# Altium project PCB_Project_1.PrjPcb
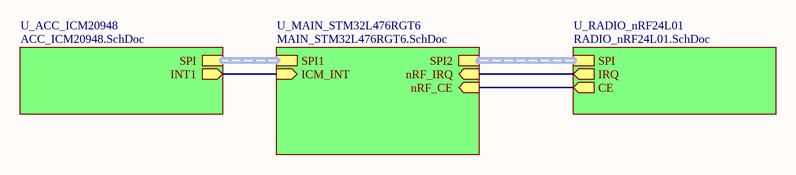
[diagram p0: mHealth.SchDoc]
4 sheets, 29 parts. Net scope: hierarchical (ports join the sheet entries above them; power ports are global).
Board file: CORE_Prototype_1.PcbDoc
Sheets:
  mHealth.SchDoc
    U_MAIN_STM32L476RGT6 = MAIN_STM32L476RGT6.SchDoc
    U_ACC_ICM20948 = ACC_ICM20948.SchDoc
    U_RADIO_nRF24L01 = RADIO_nRF24L01.SchDoc

## Sheet mHealth.SchDoc
size Letter; SheetNumber: 1

### Sub-sheets
U_ACC_ICM20948 = ACC_ICM20948.SchDoc: SPI (harness SPI), INT1 (out)
U_MAIN_STM32L476RGT6 = MAIN_STM32L476RGT6.SchDoc: nRF_IRQ (in), ICM_INT (in), SPI2 (harness SPI), nRF_CE (in), SPI1 (harness SPI)
U_RADIO_nRF24L01 = RADIO_nRF24L01.SchDoc: IRQ (out), CE (out), SPI (harness SPI)

### Nets
CE: sheet U_MAIN_STM32L476RGT6/nRF_CE, sheet U_RADIO_nRF24L01/CE
ICM_INT: sheet U_MAIN_STM32L476RGT6/ICM_INT, sheet U_ACC_ICM20948/INT1
IRQ: sheet U_MAIN_STM32L476RGT6/nRF_IRQ, sheet U_RADIO_nRF24L01/IRQ

### Buses and harness runs
harness sheet U_ACC_ICM20948/SPI = sheet U_MAIN_STM32L476RGT6/SPI1
harness sheet U_MAIN_STM32L476RGT6/SPI2 = sheet U_RADIO_nRF24L01/SPI

## Sheet MAIN_STM32L476RGT6.SchDoc
size B; SheetNumber: 4
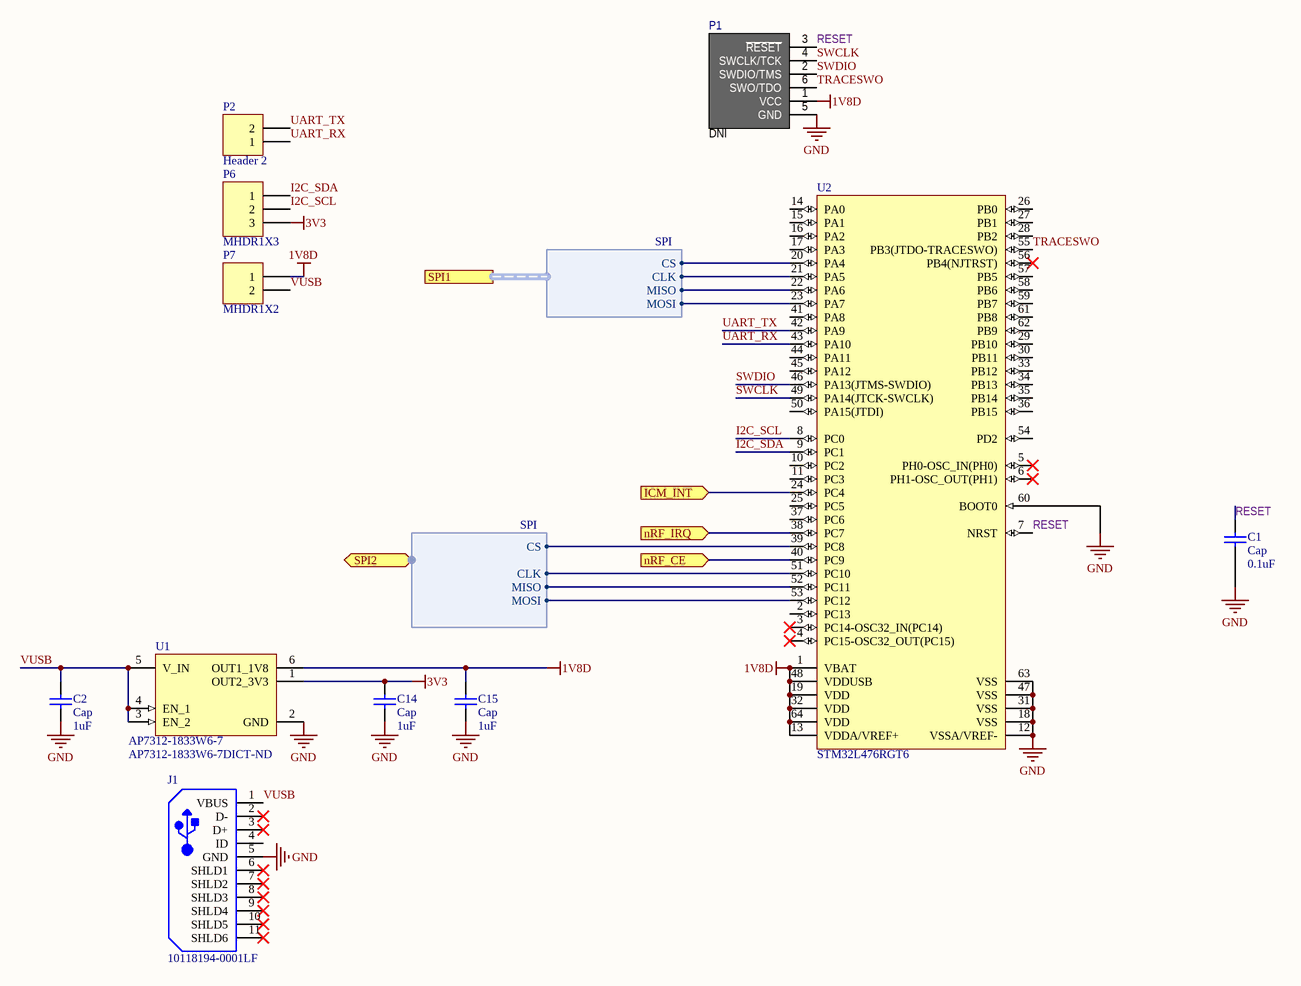
[diagram p1: MAIN_STM32L476RGT6.SchDoc]

### Parts
C1  Cap  value 0.1uF  [CAPC1005N]
C2  Cap  value 1uF  [CAPC1005N]
C14  Cap  value 1uF  [CAPC1005N]
C15  Cap  value 1uF  [CAPC1005N]
J1  10118194-0001LF  [FCI-10118194-0001LF-5_V]
P1  DNI  [TC2030]  (no BOM)
P2  Header 2  [HDR1X2-PINS]
P6  MHDR1X3  [MHDR1X3]
P7  MHDR1X2  [MHDR1X2]
U1  AP7312-1833W6-7  Supplier Part Number 1: AP7312-1833W6-7DICT-ND  [SOT95P285X145-6N]
U2  STM32L476RGT6  [STM-LQFP64_N]

### Ports
ICM_INT (in), nRF_CE (in), nRF_IRQ (in), SPI1 (harness SPI), SPI2 (bidir, harness SPI)

### Harnesses
SPI: MOSI, MISO, CS, CLK

### Nets
1V8D: C15.2 P1.1(VCC) P7.1 U1.6(OUT1_1V8) U2.1(VBAT) U2.13(VDDA/VREF+) U2.19(VDD) U2.32(VDD) U2.48(VDDUSB) U2.64(VDD)
3V3: C14.2 P6.3 U1.1(OUT2_3V3)
GND: C1.1 C2.1 C14.1 C15.1 J1.5(GND) P1.5(GND) U1.2(GND) U2.12(VSSA/VREF-) U2.18(VSS) U2.31(VSS) U2.47(VSS) U2.60(BOOT0) U2.63(VSS)
CE: U2.40(PC9) ; port nRF_CE
I2C_SCL: P6.2 U2.8(PC0)  [project net I2C_SCL_4]
I2C_SDA: P6.1 U2.9(PC1)  [project net I2C_SDA_4]
ICM_INT: U2.24(PC4) ; port ICM_INT
IRQ: U2.38(PC7) ; port nRF_IRQ
RESET: C1.2 P1.3(~{RESET}) U2.7(NRST)  [project net RESET_4]
SWCLK: P1.4(SWCLK/TCK) U2.49(PA14(JTCK-SWCLK))  [project net SWCLK_4]
SWDIO: P1.2(SWDIO/TMS) U2.46(PA13(JTMS-SWDIO))  [project net SWDIO_4]
TRACESWO: P1.6(SWO/TDO) U2.55(PB3(JTDO-TRACESWO))  [project net TRACESWO_4]
UART_RX: P2.1 U2.43(PA10)  [project net UART_RX_4]
UART_TX: P2.2 U2.42(PA9)  [project net UART_TX_4]
VUSB: C2.2 J1.1(VBUS) P7.2 U1.3(EN_2) U1.4(EN_1) U1.5(V_IN)  [project net VUSB_4]
NetP3_1: U2.20(PA4) ; port SPI1.CS
NetP3_2: U2.22(PA6) ; port SPI1.MISO
NetP3_3: U2.23(PA7) ; port SPI1.MOSI
NetP3_4: U2.21(PA5) ; port SPI1.CLK
NetP5_1: U2.51(PC10) ; port SPI2.CLK
NetP5_2: U2.53(PC12) ; port SPI2.MOSI
NetP5_3: U2.52(PC11) ; port SPI2.MISO
NetP5_4: U2.39(PC8) ; port SPI2.CS

Not connected (* = marked no-connect by the designer): J1 2(D-)* 3(D+)* 4(ID) 6(SHLD1)* 7(SHLD2)* 8(SHLD3)* 9(SHLD4)* 10(SHLD5)* 11(SHLD6)*; U2 2(PC13) 3(PC14-OSC32_IN(PC14))* 4(PC15-OSC32_OUT(PC15))* 5(PH0-OSC_IN(PH0))* 6(PH1-OSC_OUT(PH1))* 10(PC2) 11(PC3) 14(PA0) 15(PA1) 16(PA2) 17(PA3) 25(PC5) 26(PB0) 27(PB1) 28(PB2) 29(PB10) 30(PB11) 33(PB12) 34(PB13) 35(PB14) 36(PB15) 37(PC6) 41(PA8) 44(PA11) 45(PA12) 50(PA15(JTDI)) 54(PD2) 56(PB4(NJTRST))* 57(PB5) 58(PB6) 59(PB7) 61(PB8) 62(PB9)

### Library data of the parts
C1 C2 C14 C15 = Cap: Capacitor; Published: 8-Jun-2000; LatestRevisionDate: 17-Jul-2002; LatestRevisionNote: Re-released for DXP Platform.; PackageReference: RAD-0.3; Publisher: Altium Limited; PackageDescription: Radial Cap, Thru-Hole; 2 Leads; 0.3 in Pin Spacing
J1 = CMP-2000-05120-1: Micro USB B Type Receptacle, 1.8 A, -55 to 85 degC, 5-Pin SMD, RoHS, Tape and Reel; Manufacturer: Amphenol FCI; Body Orientation: RightAngle; Number of Contacts: 5; Pitch: 0.65mm; Gender: RCP; Rad Hard: No; Package Reference: 10118194-0001LF-5; Mounting: SurfaceMount; Manufacturer URL: http://www.fci.com/; Packaging: CutTape; Datasheet URL: https://datasheet.ciiva.com/26945/getdatasheetpartid-418619-26945695.pdf; Termination Method: Solder; Package Description: 5-Pin Surface Mount Device, Body 8.05 x 5.53 mm, Pitch 0.65 mm; Type: MicroUSBTypeB; Datasheet Version: Rev. A, 10/2011
P1 = TC2030-CTX
P2 = Header 2: Header, 2-Pin; LatestRevisionDate: 17-Jul-2002; LatestRevisionNote: Re-released for DXP Platform.; Publisher: Altium Limited
P6 = MHDR1X3: Header, 3-Pin; LatestRevisionDate: 17-Jul-2002; LatestRevisionNote: Re-released for DXP Platform.; Publisher: Altium Limited
P7 = MHDR1X2: Header, 2-Pin; LatestRevisionDate: 17-Jul-2002; LatestRevisionNote: Re-released for DXP Platform.; Publisher: Altium Limited
U1 = AP7312-1833W6-7: IC REG LINEAR 1.8V/3.3V SOT26; Manufacturer 1: Diodes; Number of Outputs: 2; Min Input Voltage: 2V; Max Input Voltage: 6V; Max Output Current: 150mA; Max Power Dissipation: 950mW; Polarity: Positive; Quiescent Current: 80uA; Accuracy: 2%; Output Type: Fixed; Dropout Voltage: 150mV; Output Voltage: 3.3V; Min Current Limit: 200mA; Operating Supply Current: 60uA; Voltage - Output 1: 1.8V; Reference Voltage: 800mV; Power Supply Rejection Ratio (PSRR): 65dB; Supplier 1: Digi-Key; Manufacturer Part Number 1: AP7312-1833W6-7; Stock 1: 17585; Pricing 1: 1=0.59000, 10=0.52100, 100=0.37100, 500=0.29994, 1000=0.22890 (USD); RoHS: Yes; Mount: Surface Mount; Case/Package: SOT-26; Number of Pins: 6; Contact Plating: Tin,Matte; Min Operating Temperature: -40°C; Max Operating Temperature: 85°C; Output Current: 150mA; Package Quantity: 3000; Packaging: Tape and Reel; Power Rating: 950mW; Number of Regulators: 2; Current - Output 1: 150mA; Current - Output 2: 150mA; Voltage - Output 2: 3.3V; Power Dissipation: 950mW; Output Voltage Accuracy: 2%; Length: 3.1mm; Height: 1.3mm; Width: 1.7mm; Radiation Hardening: No; REACH SVHC: No SVHC; Lead Free: Lead Free; ComponentLink1URL: https://datasheet.ciiva.com/30477/0900766b8115c2c0-30477178.pdf?src-supplier=RSComponents; ComponentLink1Description: https://datasheet.ciiva.com/30477/0900766b8115c2c0-30477178.pdf?src-supplier=RSComponents; ComponentLink2URL: https://datasheet.ciiva.com/8078/1636610-8078247.pdf?src-supplier=Element14; ComponentLink2Description: https://datasheet.ciiva.com/8078/1636610-8078247.pdf?src-supplier=Element14; ComponentLink3URL: https://datasheet.ciiva.com/8239/ap7312-8239997.pdf?src-supplier=Avnet; ComponentLink3Description: https://datasheet.ciiva.com/8239/ap7312-8239997.pdf?src-supplier=Avnet
U2 = CMP-1655-00012-2: Ultra-Low-Power ARM Cortex-M4 32-bit MCU+FPU, 1024 KB Flash, 128 KB Internal RAM, 51 I/Os, 64-Pin LQFP, -40 to 85 degC, Tray; Manufacturer: STMicroelectronics; D/A Converter: 2; Supply Voltage(Vcc) min (V): 1.71; Internal RAM Size (kB): 128; Operating Frequency(F) (Processor speed) (MHz): 80; FLASH Size (Prog) (kB): 1024; I/Os (High Current): 51; Core: ARM Cortex-M4; Package Reference: LQFP64; DatasheetVersion: Rev. 4; ComponentLink1URL: http://www.st.com/; ComponentLink2Description: Datasheet; Mounting Technology: Surface Mount; Package Description: 64-Pin Low-profile Quad Flat Package, Body 10 x 10 mm, Pitch 0.5 mm; ComponentLink1Description: Manufacturer URL; ComponentLink2URL: http://www.st.com/st-web-ui/static/active/en/resource/technical/document/datasheet/DM00108832.pdf; Packing: Tray; PartNumber: STM32L476RGT6

## Sheet ACC_ICM20948.SchDoc
size A; SheetNumber: 2
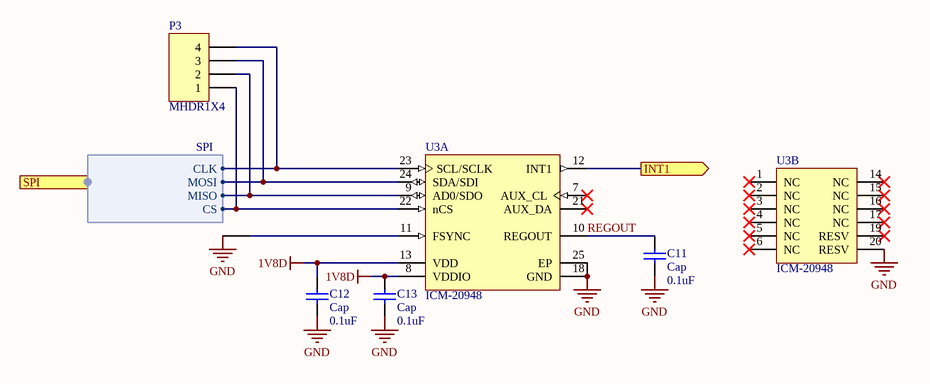
[diagram p2: ACC_ICM20948.SchDoc]

### Parts
C11  Cap  value 0.1uF  [CAPC1005N]
C12  Cap  value 0.1uF  [CAPC1005N]
C13  Cap  value 0.1uF  [CAPC1005N]
P3  MHDR1X4  [MHDR1X4]
U3  ICM-20948  [TDK-QFN-24_M]  (parts A,B of 2)

### Ports
INT1 (out), SPI (harness SPI)

### Harnesses
SPI: MOSI, MISO, CS, CLK

### Nets
1V8D: C12.2 C13.2 U3.8(VDDIO) U3.13(VDD)
GND: C11.1 C12.1 C13.1 U3.11(FSYNC) U3.18(GND) U3.20(RESV) U3.25(EP)
ICM_INT: U3.12(INT1) ; port INT1
REGOUT: C11.2 U3.10(REGOUT)  [project net REGOUT_2]
NetP3_1: P3.1 U3.22(nCS) ; port SPI.CS
NetP3_2: P3.2 U3.9(AD0/SDO) ; port SPI.MISO
NetP3_3: P3.3 U3.24(SDA/SDI) ; port SPI.MOSI
NetP3_4: P3.4 U3.23(SCL/SCLK) ; port SPI.CLK

Not connected (* = marked no-connect by the designer): U3 1(NC)* 2(NC)* 3(NC)* 4(NC)* 5(NC)* 6(NC)* 7(AUX_CL)* 14(NC)* 15(NC)* 16(NC)* 17(NC)* 19(RESV)* 21(AUX_DA)*

### Library data of the parts
C11-C13 = Cap: Capacitor; Published: 8-Jun-2000; LatestRevisionDate: 17-Jul-2002; LatestRevisionNote: Re-released for DXP Platform.; PackageReference: RAD-0.3; Publisher: Altium Limited; PackageDescription: Radial Cap, Thru-Hole; 2 Leads; 0.3 in Pin Spacing
P3 = MHDR1X4: Header, 4-Pin; LatestRevisionDate: 17-Jul-2002; LatestRevisionNote: Re-released for DXP Platform.; Publisher: Altium Limited
U3 = CMP-2000-07532-1: World’s Lowest Power 9-Axis MEMS MotionTracking(TM) Device, 1.71 to 3.6 V, -40 to 85 degC, 24-Pin QFN, RoHS, Tape and Reel; Manufacturer: TDK; Package Description: 24-Pin Quad Flat No-lead Package, Body 3 x 3 mm, Pitch 0.4 mm; Datasheet Version: Rev. 1.3, 06/2017; Package Reference: QFN-24; Mounting Technology: SurfaceMount; Datasheet URL: https://www.invensense.com/wp-content/uploads/2016/06/DS-000189-ICM-20948-v1.3.pdf; Manufacturer URL: http://www.tdk.com/

## Sheet RADIO_nRF24L01.SchDoc
size A; SheetNumber: 5
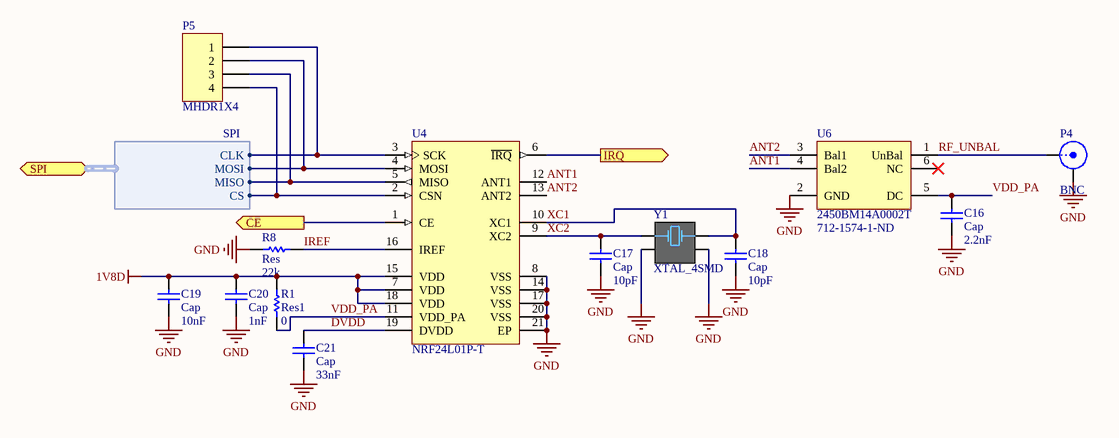
[diagram p3: RADIO_nRF24L01.SchDoc]

### Parts
C16  Cap  value 2.2nF  [CAPC1005N]
C17  Cap  value 10pF  [CAPC1005N]
C18  Cap  value 10pF  [CAPC1005N]
C19  Cap  value 10nF  [CAPC1005N]
C20  Cap  value 1nF  [CAPC1005N]
C21  Cap  value 33nF  [CAPC1005N]
P4  BNC  [MCB3-V4]
P5  MHDR1X4  [MHDR1X4]
R1  Res1  value 0  [RESC1005N]
R8  Res  value 22k  [RESC1005N]
U4  NRF24L01P-T  [NRSC-QFN-20_L]
U6  2450BM14A0002T  Supplier Part Number 1: 712-1574-1-ND  [2450BM14A0002]
Y1  XTAL_4SMD  [XTAL3225-4-N]

### Ports
CE (out), IRQ (out), SPI (bidir, harness SPI)

### Harnesses
SPI: MOSI, MISO, CS, CLK

### Nets
1V8D: C19.2 C20.2 R1.2 U4.7(VDD) U4.15(VDD) U4.18(VDD)
GND: C16.1 C17.1 C18.1 C19.1 C20.1 C21.1 P4.2(Y) R8.1 U4.8(VSS) U4.14(VSS) U4.17(VSS) U4.20(VSS) U4.21(EP) U6.2(GND) Y1.2 Y1.4
ANT1: U4.12(ANT1) U6.4(Bal2)  [project net ANT1_5]
ANT2: U4.13(ANT2) U6.3(Bal1)  [project net ANT2_5]
CE: U4.1(CE) ; port CE
DVDD: C21.2 U4.19(DVDD)  [project net DVDD_5]
IREF: R8.2 U4.16(IREF)  [project net IREF_5]
IRQ: U4.6(~{IRQ}) ; port IRQ
RF_UNBAL: P4.1(X) U6.1(UnBal)  [project net RF_UNBAL_5]
VDD_PA: C16.2 R1.1 U4.11(VDD_PA) U6.5(DC)  [project net VDD_PA_5]
XC1: C18.2 U4.10(XC1) Y1.3(OSC2)  [project net XC1_5]
XC2: C17.2 U4.9(XC2) Y1.1(OSC1)  [project net XC2_5]
NetP5_1: P5.1 U4.3(SCK) ; port SPI.CLK
NetP5_2: P5.2 U4.4(MOSI) ; port SPI.MOSI
NetP5_3: P5.3 U4.5(MISO) ; port SPI.MISO
NetP5_4: P5.4 U4.2(CSN) ; port SPI.CS

Not connected (* = marked no-connect by the designer): U6 6(NC)*

### Library data of the parts
C16-C21 = Cap: Capacitor; Published: 8-Jun-2000; LatestRevisionDate: 17-Jul-2002; LatestRevisionNote: Re-released for DXP Platform.; PackageReference: RAD-0.3; Publisher: Altium Limited; PackageDescription: Radial Cap, Thru-Hole; 2 Leads; 0.3 in Pin Spacing
P4 = BNC: BNC Elbow Connector; LatestRevisionDate: 17-Jul-2002; LatestRevisionNote: Re-released for DXP Platform.; Publisher: Altium Limited
P5 = MHDR1X4: Header, 4-Pin; LatestRevisionDate: 17-Jul-2002; LatestRevisionNote: Re-released for DXP Platform.; Publisher: Altium Limited
R1 R8 = Res1: Resistor; Published: 8-Jun-2000; LatestRevisionDate: 17-Jul-2002; LatestRevisionNote: Re-released for DXP Platform.; PackageReference: AXIAL-0.3; Publisher: Altium Limited; PackageDescription: Axial Device, Thru-Hole; 2 Leads; 0.3 in Pin Spacing
U4 = CMP-2000-06859-1: Single Chip Transceiver, 2.4 GHz, 60 mW, 1.9 to 3.6 V, -40 to 85 degC, 20-Pin QFN, RoHS, Tray; Manufacturer: Nordic Semiconductor; Data Rate (Max): 2Mbps; Current - Transmitting: 7mA~11.3mA; Power - Output: 0dBm; Other Names: 1490-1019; Online Catalog: nRF24L01+; Current - Receiving: 12.6mA~13.5mA; For Use With: 1490-1002-ND-KITEVALUATIONNRF24L01P1568-1295-ND-SPARKFUNTRANSCEIVERBREAKOUT-1568-1296-ND-SPARKFUNTRANSCEIVERBREAKOUT-1471-1410-ND-DEVBOARDNRFSCLICKNRF24L01P-MODULE-PCB-ND-KITEVALNRF24L01+PCBANTENNANRF24L01P-MODULE-SMA-ND-KITEVALNRF24L01+SMACONNNRF24L01P-UPGRADE-ND-UPGRADE2PCB/1SMANRF24L01103990038-ND-DEVDUINOSENSORNODEV1.3103990053-ND-DEVDUINOSENSORNODEV2(ATMEGA103990074-ND-DEVDUINOSENSORNODE106990026-ND-ENERGYMONITORSHIELDV2113990088-ND-WIRELESSGATESHIELD113990095-ND-DEVDUINOSENSORNODEV3(ATMEGA106030001-ND-ENERGYMONITORSHIELD1597-1361-ND-DEVDUINOSENSORNODEV2.2(ATMEG105990030-ND-RGBWSTRIPWIRELESSSHIELDV1.0; Frequency: 2.4GHz; Design Resources: DevelopmentToolSelector; RF Family/Standard: GeneralISM>1GHZ; Serial Interfaces: SPI; Sensitivity: -94dBm; Voltage - Supply: 1.9V~3.6V; Modulation: GFSK; GPIO: -; Package Reference: QFN20; Memory Size: -; Category: RF/IFandRFID; Type: TxRxOnly; Standard Package: 490; Package / Case: 20-VFQFNExposedPad; Packaging: Tray; Series: -; Package Description: 20-Pin Quad Flat No-lead Package, Body 4 x 4 mm, Pitch 0.5 mm; Datasheet Version: Rev. 1.0, 09/2008; Protocol: -; Manufacturer URL: http://www.nordicsemi.com/eng/Products/; Operating Temperature: -40°C~85°C; Family: RFTransceiverICs; Datasheet URL: http://www.nordicsemi.com/eng/content/download/2726/34069/file/nRF24L01P_Product_Specification_1_0.pdf; Mounting Technology: SurfaceMount
U6 = 2450BM14A0002T: JOHANSON TECHNOLOGY - 2450BM14A0002T - BALUN, 2.45GHZ, IMPEDANCE MATCHED; Impedance: 50R; Insertion Loss: 2dB; Max Frequency: 2.5GHz; Return Loss: 9.5dB; Supplier 1: Digi-Key; Manufacturer 1: Johanson; Manufacturer Part Number 1: 2450BM14A0002T; Stock 1: 68815; Pricing 1: 1=0.94000, 10=0.83000, 25=0.74960, 100=0.65600, 250=0.57568, 500=0.50872, 1000=0.40163 (USD); RoHS: Yes; Mount: Surface Mount; Case/Package: 0603; Number of Pins: 6; Case Code (Metric): 1608; Case Code (Imperial): 0603; Contact Plating: Tin,Matte; Min Operating Temperature: -40°C; Max Operating Temperature: 85°C; Package Quantity: 4000; Packaging: Tape and Reel; Frequency: 2.45GHz; Termination: SMD/SMT; REACH SVHC: Unknown; ComponentLink1URL: https://datasheet.ciiva.com/7662/1644648-7662569.pdf?src-supplier=Element14; ComponentLink1Description: https://datasheet.ciiva.com/7662/1644648-7662569.pdf?src-supplier=Element14; ComponentLink2URL: https://datasheet.ciiva.com/29655/balun-filter-matched-2450bm14a0002-v2-29655610.pdf?src-supplier=Digi-Key; ComponentLink2Description: https://datasheet.ciiva.com/29655/balun-filter-matched-2450bm14a0002-v2-29655610.pdf?src-supplier=Digi-Key; ComponentLink3URL: https://datasheet.ciiva.com/24023/2450bm14a0002t-247800-24023183.pdf?src-supplier=Mouser; ComponentLink3Description: https://datasheet.ciiva.com/24023/2450bm14a0002t-247800-24023183.pdf?src-supplier=Mouser
Y1 = XTAL_4SMD: Crystal Oscillator (4 pin); Published: 8-Jun-2000; LatestRevisionDate: 17-Jul-2002; LatestRevisionNote: Re-released for DXP Platform.; PackageReference: R38; Publisher: Altium Limited; PackageDescription: Crystal, Thru-Hole; 2 Leads; Body 3.1 x 8.2 mm (Dia.xH)

## Nets that join several sheets
1V8D: MAIN_STM32L476RGT6 (10 pins), ACC_ICM20948 (C12.2 C13.2 U3.8 U3.13), RADIO_nRF24L01 (6 pins)
GND: MAIN_STM32L476RGT6 (13 pins), ACC_ICM20948 (7 pins), RADIO_nRF24L01 (16 pins)
CE: MAIN_STM32L476RGT6 (U2.40), RADIO_nRF24L01 (U4.1)
ICM_INT: MAIN_STM32L476RGT6 (U2.24), ACC_ICM20948 (U3.12)
IRQ: MAIN_STM32L476RGT6 (U2.38), RADIO_nRF24L01 (U4.6)
NetP3_1: MAIN_STM32L476RGT6 (U2.20), ACC_ICM20948 (P3.1 U3.22)
NetP3_2: MAIN_STM32L476RGT6 (U2.22), ACC_ICM20948 (P3.2 U3.9)
NetP3_3: MAIN_STM32L476RGT6 (U2.23), ACC_ICM20948 (P3.3 U3.24)
NetP3_4: MAIN_STM32L476RGT6 (U2.21), ACC_ICM20948 (P3.4 U3.23)
NetP5_1: MAIN_STM32L476RGT6 (U2.51), RADIO_nRF24L01 (P5.1 U4.3)
NetP5_2: MAIN_STM32L476RGT6 (U2.53), RADIO_nRF24L01 (P5.2 U4.4)
NetP5_3: MAIN_STM32L476RGT6 (U2.52), RADIO_nRF24L01 (P5.3 U4.5)
NetP5_4: MAIN_STM32L476RGT6 (U2.39), RADIO_nRF24L01 (P5.4 U4.2)